# EAGLE design Temperature_GUN_pro (EAGLE 7.7.0)

## Sheet 1 of 2
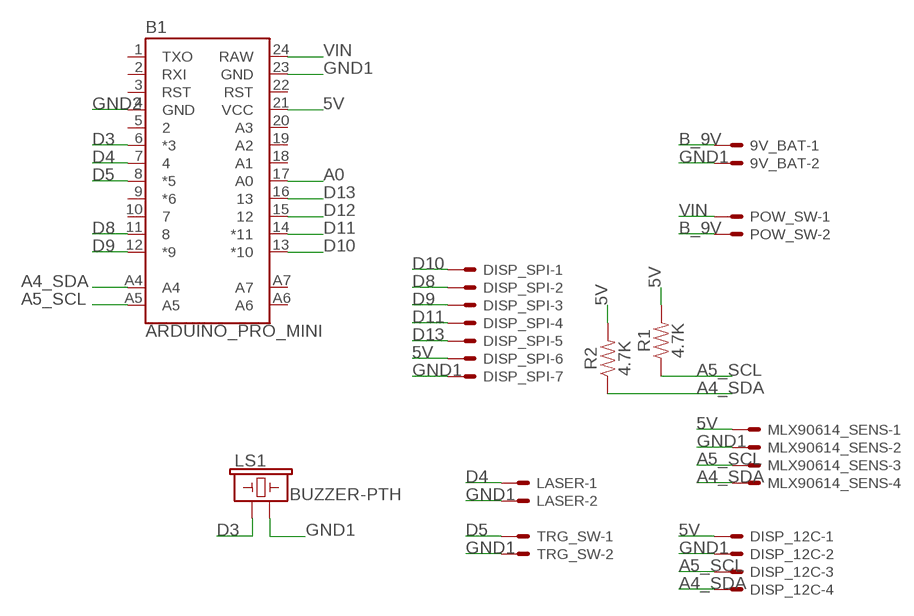
[diagram p0: schematic, sheet 1]

### Parts
9V_BAT  JST-XH-02-PIN-ROUND-PAD  [JST-XH-02-PACKAGE-ROUND-PAD]
B1  ARDUINO_PRO_MINI  [ARDUINO_PRO_MINI]
DISP_12C  JST-XH-04-PIN-ROUND-PAD  [JST-XH-04-PACKAGE-ROUND-PAD]
DISP_SPI  JST-XH-07-PIN-ROUND-PAD  [JST-XH-07-PACKAGE-ROUND-PAD]
LASER  JST-XH-02-PIN-ROUND-PAD  [JST-XH-02-PACKAGE-ROUND-PAD]
LS1  BUZZER-PTH  [BUZZER-12MM]
MLX90614_SENS  JST-XH-04-PIN-ROUND-PAD  [JST-XH-04-PACKAGE-ROUND-PAD]
POW_SW  JST-XH-02-PIN-ROUND-PAD  [JST-XH-02-PACKAGE-ROUND-PAD]
R1  4.7K  1KOHM-HORIZ-1/4W-1%  [AXIAL-0.3]
R2  4.7K  1KOHM-HORIZ-1/4W-1%  [AXIAL-0.3]
TRG_SW  JST-XH-02-PIN-ROUND-PAD  [JST-XH-02-PACKAGE-ROUND-PAD]

### Nets
5V: B1.21(VCC) DISP_12C.1 DISP_SPI.6 MLX90614_SENS.1 R1.P$2 R2.P$2
A0: B1.17(A0)
A4_SDA: B1.A4 DISP_12C.4 MLX90614_SENS.4 R2.P$1
A5_SCL: B1.A5 DISP_12C.3 MLX90614_SENS.3 R1.P$1
B_9V: 9V_BAT.1 POW_SW.2
D3: B1.6(*3) LS1.+
D4: B1.7 LASER.1
D5: B1.8(*5) TRG_SW.1
D8: B1.11 DISP_SPI.2
D9: B1.12(*9) DISP_SPI.3
D10: B1.13(*10) DISP_SPI.1
D11: B1.14(*11) DISP_SPI.4
D12: B1.15
D13: B1.16 DISP_SPI.5
GND1: 9V_BAT.2 B1.23(GND) DISP_12C.2 DISP_SPI.7 LASER.2 LS1.- MLX90614_SENS.2 TRG_SW.2
GND2: B1.4(GND)
VIN: B1.24(RAW) POW_SW.1
Unconnected: B1.1(TXO) B1.2(RXI) B1.3(RST) B1.5 B1.9(*6) B1.10 B1.18(A1) B1.19(A2) B1.20(A3) B1.22(RST) B1.A6 B1.A7

## Sheet 2 of 2

## Library data of the parts
9V_BAT LASER POW_SW TRG_SW = Rembrandt Electronics - JST XH Connectors v1-0:JST-XH-02-PIN: JST XH Connector 2 Pin Wire to board connector. Pitch: 2,54 mm, (0.100") Number of pins: 2 Created by Rembrandt Electronics www.rembrandtelectronics.com
B1 = SparkFun-Boards_MOD:ARDUINO_PRO_MINI: SparkFun Pro Mini Pro Mini compatible footprint. Dimensions: 0.7 x 1.3" PCB Thickness: 0.8mm SparkFun Products: 3.3V/8MHz <https://www.sparkfun.com/products/11114> 5V/16MHz <https://www.sparkfun.com/products/11113>
DISP_12C MLX90614_SENS = Rembrandt Electronics - JST XH Connectors v1-0:JST-XH-04-PIN: JST XH Connector 2 Pin Wire to board connector. Pitch: 2,54 mm, (0.100") Number of pins: 4 Created by Rembrandt Electronics www.rembrandtelectronics.com
DISP_SPI = Rembrandt Electronics - JST XH Connectors v1-0:JST-XH-07-PIN: JST XH Connector 2 Pin Wire to board connector. Pitch: 2,54 mm, (0.100") Number of pins: 7 Created by Rembrandt Electronics www.rembrandtelectronics.com
LS1 = SparkFun-Electromechanical:BUZZER: Buzzer Small round buzzers that operate around the audible 2kHz range. You can use these as speakers to create simple music or user interfaces. Variant Overview: PTH - Mini Speaker - PC Mount 12mm 2.048kHz <https://www.sparkfun.com/products/7950> PTH_KIT - Mini Speaker - PC Mount 12mm 2.048kHz <https://www.sparkfun.com/products/7950> KIT simplifies soldering by adding stop mask to one side of the pads. PTH_NO_SILK - Mini Speaker - PC Mount 12mm 2.048kHz <https://www.sparkfun.com/products/7950> No silkscreen indicator of buzzer outline. PTH_KIT_NO_SILK - Mini Speaker - PC Mount 12mm 2.048kHz <https://www.sparkfun.com/products/7950> KIT package w/o silkscreen SMD - Buzzer Audio Magnetic (CCV-084B16) SMD buzzer used on, e.g. the LilyPad Buzzer <https://www.sparkfun.com/products/8463> and RFID USB Reader <https://www.sparkfun.com/products/9963>. SMD_KIT - Buzzer Audio Magnetic (CCV-084B16) SMD Buzzer with elongated pins to make soldering easier. Used on the SparkFun Simon Says - Surface Mount Soldering Kit <https://www.sparkfun.com/products/10935>.; PROD_ID: COMP-08253; SF_SKU: COM-07950
R1 R2 = SparkFun-Resistors:1KOHM: 1kΩ resistor A resistor is a passive two-terminal electrical component that implements electrical resistance as a circuit element. Resistors act to reduce current flow, and, at the same time, act to lower voltage levels within circuits. - Wikipedia; PROD_ID: RES-12182; VALUE: 1k

## Board
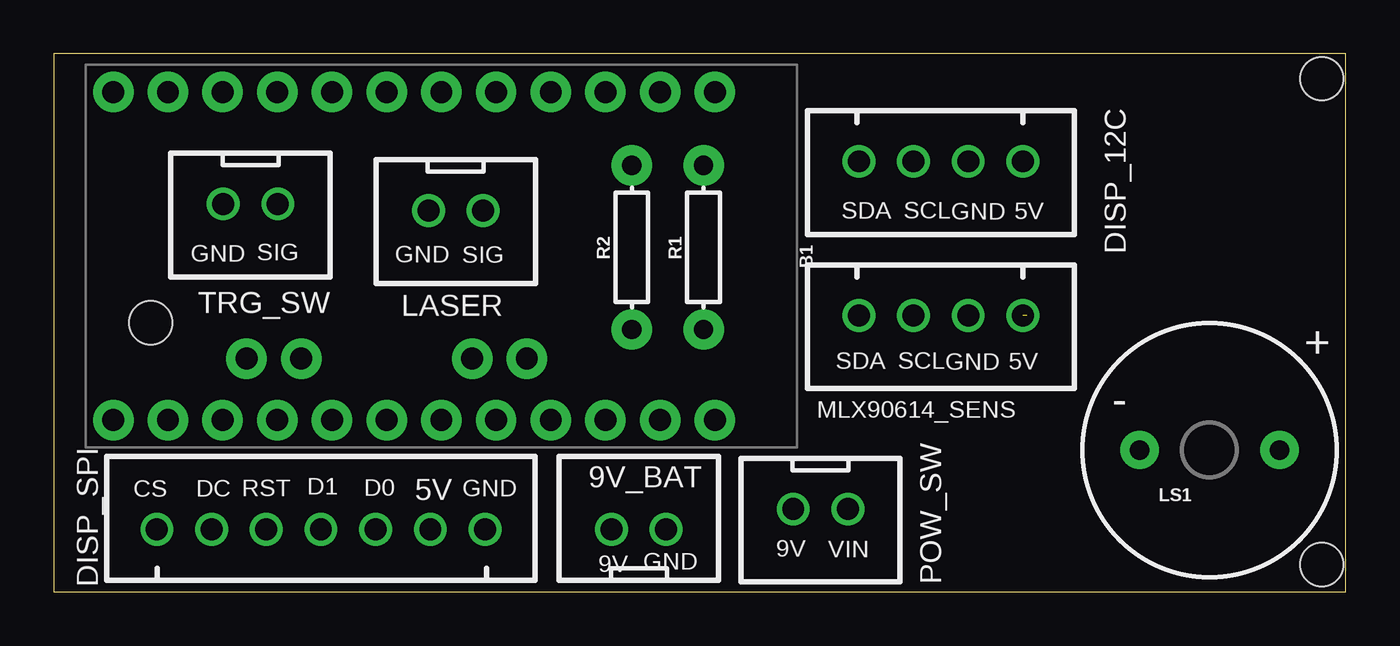
[diagram p1: board, top side]
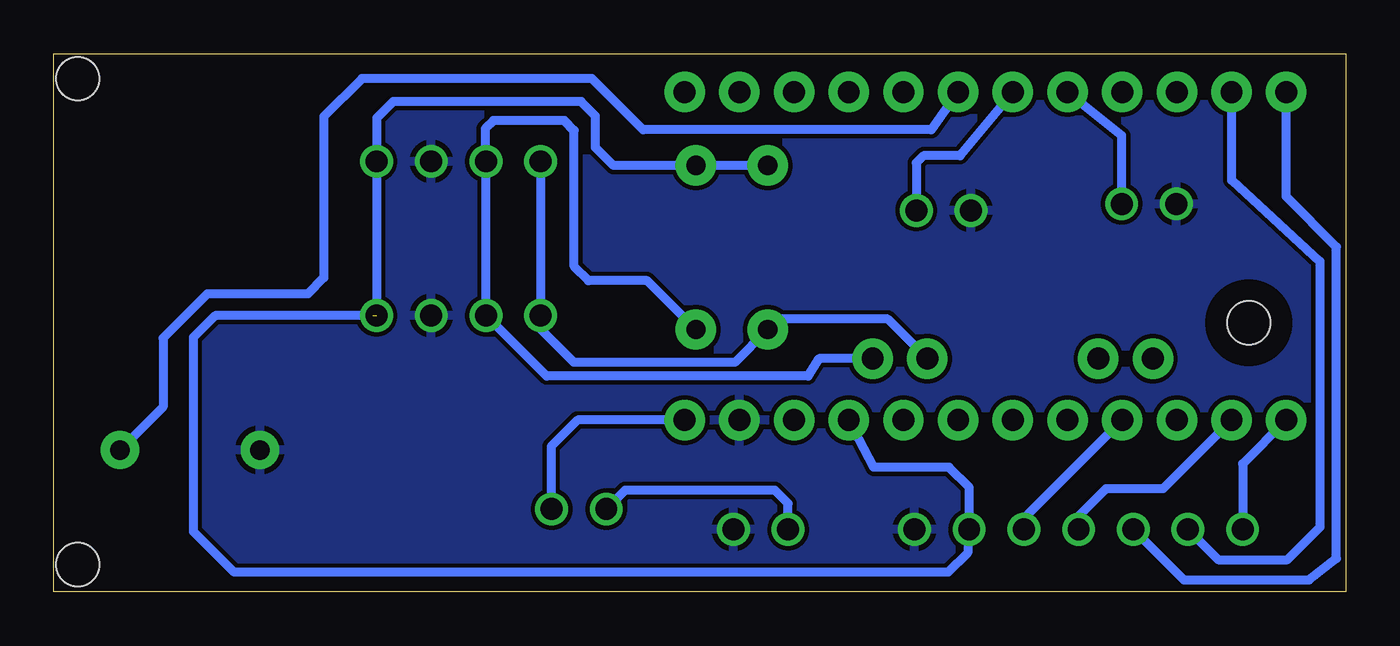
[diagram p2: board, bottom side, seen from below]

Size 60 x 25 mm. Coordinates in mm from the lower left corner, seen from the top.
Outline: 0,0 60,0 60,25 0,25 0,0
Copper layers (1*16): Top 0.035mm / dielectric 1.5mm / Bottom 0.035mm
Design rules "default": minimum track width 10mil, minimum drill 24mil, track to track 8mil, track to pad 8mil, pad to pad 8mil, via to via 8mil, smd to smd 8mil, copper to edge 40mil, drill to drill 8mil, minimum pad ring 10mil, minimum via ring 8mil, stop-mask expansion 4mil, vias tented up to drill 0mil, thermal gap 10mil
Holes 2 mm at 58.89,1.27 58.89,23.84 4.5,12.5

### Footprints (pad centres in the part's own frame; a part is rotated, then mirrored left to right if it is on the bottom)
JST-XH-02-PACKAGE-ROUND-PAD = drill 1.016: 1 -1.27,0; 2 1.27,0
ARDUINO_PRO_MINI = drill 1.016 pad 1.88: 1 -7.62,12.7; 2 -7.62,10.16; 3 -7.62,7.62; 4 -7.62,5.08; 5 -7.62,2.54; 6 -7.62,0; 7 -7.62,-2.54; 8 -7.62,-5.08; 9 -7.62,-7.62; 10 -7.62,-10.16; 11 -7.62,-12.7; 12 -7.62,-15.24; 13 7.62,-15.24; 14 7.62,-12.7; 15 7.62,-10.16; 16 7.62,-7.62; 17 7.62,-5.08; 18 7.62,-2.54; 19 7.62,0; 20 7.62,2.54; 21 7.62,5.08; 22 7.62,7.62; 23 7.62,10.16; 24 7.62,12.7; A4 4.763,1.429; A5 4.763,3.969; A6 4.763,-9.049; A7 4.763,-6.509
JST-XH-04-PACKAGE-ROUND-PAD = drill 1.016: 1 -3.81,0; 2 -1.27,0; 3 1.27,0; 4 3.81,0
JST-XH-07-PACKAGE-ROUND-PAD = drill 1.016: 1 -7.62,0; 2 -5.08,0; 3 -2.54,0; 4 0,0; 5 2.54,0; 6 5.08,0; 7 7.62,0
BUZZER-12MM = drill 0.9 pad 1.778: + 3.25,0; - -3.25,0
AXIAL-0.3 = drill 0.9 pad 1.88: P$1 -3.81,0; P$2 3.81,0

### Placement (x,y rotation side)
9V_BAT  27.17,2.9 0 top
B1  18,15.6 270 top
DISP_12C  41.2,20 180 top
DISP_SPI  12.41,2.9 0 top
LASER  18.67,17.72 180 top
LS1  53.67,6.59 0 top
MLX90614_SENS  41.2,12.84 180 top
POW_SW  35.61,3.85 180 top
R1  30.17,16 90 top
R2  26.84,16 90 top
TRG_SW  9.13,18.02 180 top

### Tracks (layer width: path | path; a pad name or v marks a point on that pad's centre or on a via)
5V  (1 unrouted)
  Bottom 0.406: B1.21 21.91,5.79 18.42,5.79 17.48,4.85 DISP_SPI.6 17.56,2.83 17.56,1.82 18.46,0.91 51.62,0.91 53.52,2.81 53.52,11.82 52.5,12.84 45.18,12.84 | MLX90614_SENS.1 DISP_12C.1 45,22.02 44.24,22.78 35.51,22.78 34.84,22.11 34.84,20.65 34,19.81 R1.P$2 R2.P$2
A4_SDA
  Bottom 0.406: DISP_12C.4 MLX90614_SENS.4 37.39,12.22 35.84,10.66 28.37,10.66 R2.P$1 26.36,12.67 21.27,12.67 B1.A4
A5_SCL
  Bottom 0.406: B1.A5 24.45,10.84 24.96,10.02 37.11,10.02 MLX90614_SENS.3 DISP_12C.3 39.96,20.03 39.96,21.52 39.58,21.9 36.28,21.9 35.83,21.44 35.83,15.12 35.17,14.46 32.45,14.46 R1.P$1
B_9V
  Bottom 0.406: 9V_BAT.1 25.9,4.11 26.52,4.72 33.46,4.72 POW_SW.2
D3
  Bottom 0.406: B1.6 19.25,21.47 32.63,21.47 35.01,23.85 45.69,23.85 47.46,22.08 47.46,14.6 48.21,13.85 52.87,13.85 54.92,11.79 54.92,8.59 LS1.+
D4
  Bottom 0.406: B1.7 17.91,20.27 19.61,20.27 19.94,19.93 LASER.1
D5
  Bottom 0.406: TRG_SW.1 10.4,21.2 B1.8
D8
  Bottom 0.406: DISP_SPI.2 5.92,1.49 2.71,1.49 1.19,3.01 1.19,15.35 5.3,19.12 B1.11
D9
  Bottom 0.406: DISP_SPI.3 7.51,0.55 1.7,0.55 0.43,1.55 0.43,16.03 2.76,18.37 B1.12
D10
  Bottom 0.406: B1.13 4.79,5.96 DISP_SPI.1
D11
  Bottom 0.406: B1.14 8.49,4.79 11.13,4.79 12.4,3.52 DISP_SPI.4
D13
  Bottom 0.406: B1.16 14.95,3.42 DISP_SPI.5
GND1
  pour Bottom: 59.8,24.97 59.97,0.06 0.06,0.1 -0.01,25.03
VIN
  Bottom 0.406: B1.24 35.67,7.98 36.9,6.75 36.9,3.87 POW_SW.1

### Text on the board
tNames: SDA | SCL | GND | 5V | GND | SIG | GND | SIG | + | SDA | SCL | GND | 5V | - | CS | DC | RST | D1 | D0 | 5V | GND | 9V | GND | 9V | VIN